# EAGLE design pinoccio (EAGLE 6.2)
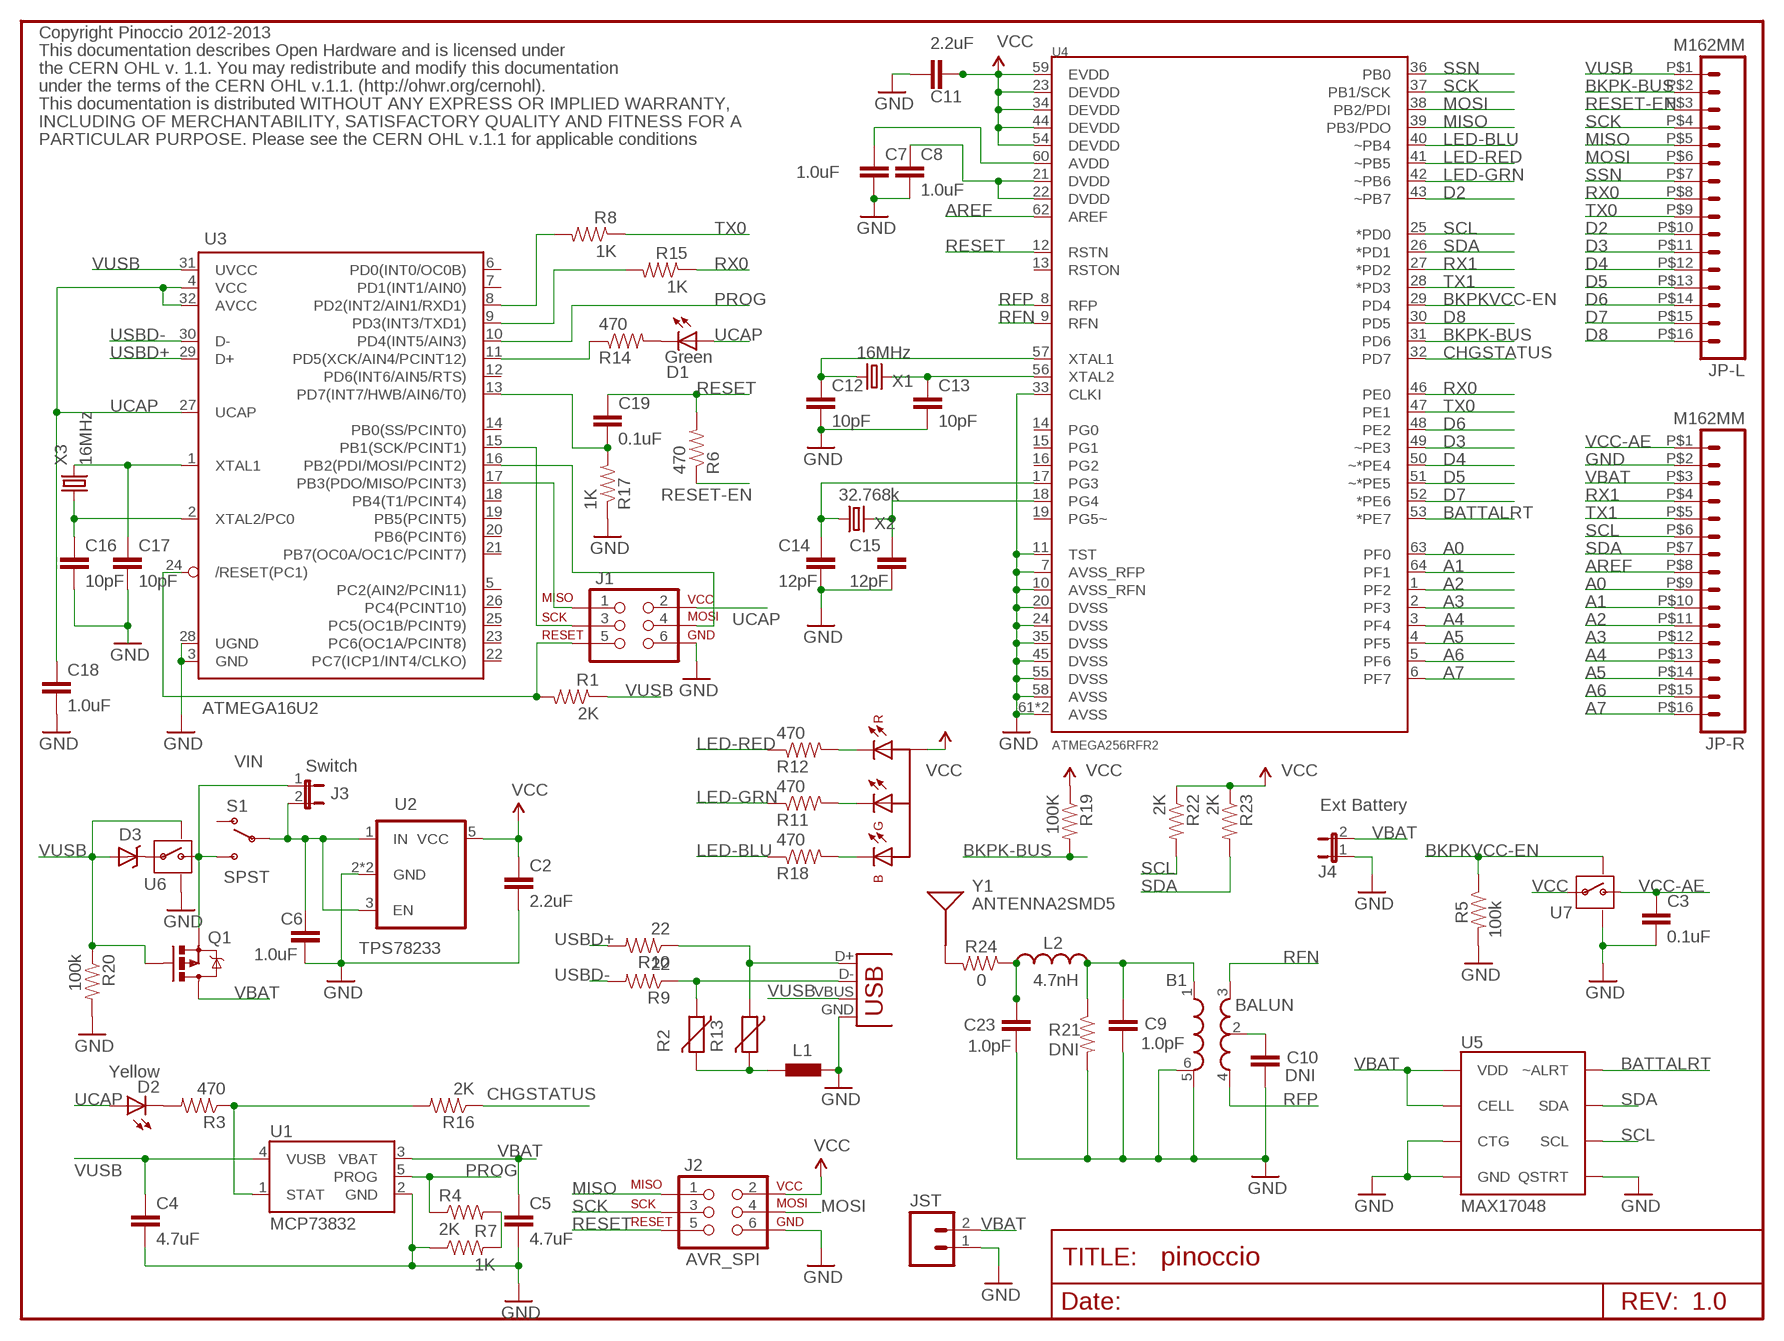
[diagram p0: schematic, sheet 1]

## Parts
B1  BALUN  BALUN0805  [BALUN]
C2  2.2uF  CAP0402-CAP  [0402-CAP]
C3  0.1uF  CAP0402-CAP  [0402-CAP]
C4  4.7uF  CAP0402-CAP  [0402-CAP]
C5  4.7uF  CAP0402-CAP  [0402-CAP]
C6  1.0uF  CAP0402-CAP  [0402-CAP]
C7  1.0uF  CAP0402-CAP  [0402-CAP]
C8  1.0uF  CAP0402-CAP  [0402-CAP]
C9  1.0pF  CAP0402-CAP  [0402-CAP]
C10  DNI  CAP0402-CAP  [0402-CAP]
C11  2.2uF  CAP0402-CAP  [0402-CAP]
C12  10pF  CAP0402-CAP  [0402-CAP]
C13  10pF  CAP0402-CAP  [0402-CAP]
C14  12pF  CAP0402-CAP  [0402-CAP]
C15  12pF  CAP0402-CAP  [0402-CAP]
C16  10pF  CAP0402-CAP  [0402-CAP]
C17  10pF  CAP0402-CAP  [0402-CAP]
C18  1.0uF  CAP0402-CAP  [0402-CAP]
C19  0.1uF  CAP0402-CAP  [0402-CAP]
C23  1.0pF  CAP0402-CAP  [0402-CAP]
D1  Green  LED0603  [LED-0603]
D2  Yellow  LED0603  [LED-0603]
D3  DIODE-SCHOTTKY  [0603-DIODE]
J1  AVR_SPI_PRG_6  [2X3-PAD]
J2  AVR_SPI  AVR_SPI_PRG_6  [2X3-PAD]
J3  Switch  JUMPER-2PTH  [1X02]
J4  Ext Battery  JUMPER-2PTH  [1X02]
JP-L  M162MM  [1X16_2MM]
JP-R  M162MM  [1X16_2MM]
JST  M02JST-SFH  [JST-SFH]
L1  BEAD  BML15H0603  [0603]
L2  4.7nH  INDUCTOR  [0402-CAP]
Q1  PFET  MOSFET-PCHANNELSMD  [SOT23-3]
R1  2K  RESISTOR0402-RES  [0402-RES]
R2  VAR  VARISTOR0402  [0402]
R3  470  RESISTOR0402-RES  [0402-RES]
R4  2K  RESISTOR0402-RES  [0402-RES]
R5  100k  RESISTOR0402-RES  [0402-RES]
R6  470  RESISTOR0402-RES  [0402-RES]
R7  1K  RESISTOR0402-RES  [0402-RES]
R8  1K  RESISTOR0402-RES  [0402-RES]
R9  22  RESISTOR0402-RES  [0402-RES]
R10  22  RESISTOR0402-RES  [0402-RES]
R11  470  RESISTOR0402-RES  [0402-RES]
R12  470  RESISTOR0402-RES  [0402-RES]
R13  VAR  VARISTOR0402  [0402]
R14  470  RESISTOR0402-RES  [0402-RES]
R15  1K  RESISTOR0402-RES  [0402-RES]
R16  2K  RESISTOR0402-RES  [0402-RES]
R17  1K  RESISTOR0402-RES  [0402-RES]
R18  470  RESISTOR0402-RES  [0402-RES]
R19  100K  RESISTOR0402-RES  [0402-RES]
R20  100k  RESISTOR0402-RES  [0402-RES]
R21  DNI  RESISTOR0402-RES  [0402-RES]
R22  2K  RESISTOR0402-RES  [0402-RES]
R23  2K  RESISTOR0402-RES  [0402-RES]
R24  0  RESISTOR0402-RES  [0402-RES]
S1  SPST  SWITCH-SPSTSMD2  [SWITCH-SPDT-SMD]
U1  MCP73832  [SOT23-5]
U2  TPS78233  LDO-TPS78233  [SOT23-5]
U3  ATMEGA16U2  ATMEGA16U2QFN32  [QFN-32]
U4  ATMEGA256RFR2  ATMEGA128RFA1  [QFN-64]
U5  MAX17048  MAX17048DFN8  [DFN-8]
U6  SWITCH  SWITCH-MOSFETTDFN4  [TDFN4]
U7  SWITCH  SWITCH-MOSFETTDFN4  [TDFN4]
U8  LED-RGB  LED-RGBPLCC4  [PLCC4]
USB-JACK  USB-MICROB  [USB-MICROB]
X1  16MHz  CRYSTALABM10  [CRYSTAL-SMD-2.5X2-ABM10]
X2  32.768k  CRYSTAL-NOGND  [CRYSTAL-SMD-2X1.2-ABS06]
X3  16MHz  CRYSTALABM10  [CRYSTAL-SMD-2.5X2-ABM10]
Y1  ANTENNA2SMD5  [ANTENNA-CHIP5]

## Nets
A0: JP-R.P$9 U4.63(PF0)
A1: JP-R.P$10 U4.64(PF1)
A2: JP-R.P$11 U4.1(PF2)
A3: JP-R.P$12 U4.2(PF3)
A4: JP-R.P$13 U4.3(PF4)
A5: JP-R.P$14 U4.4(PF5)
A6: JP-R.P$15 U4.5(PF6)
A7: JP-R.P$16 U4.6(PF7)
AREF: JP-R.P$8 U4.62(AREF)
BATTALRT: U4.53(*PE7) U5.P$5(~ALRT)
BKPK-BUS: JP-L.P$2 R19.2 U4.31(PD6)
BKPKVCC-EN: R5.1 U4.29(PD4) U7.P$4(ON)
CHGSTATUS: R16.1 U4.32(PD7)
D2: JP-L.P$10 U4.43(~PB7)
D3: JP-L.P$11 U4.49(~PE3)
D4: JP-L.P$12 U4.50(~*PE4)
D5: JP-L.P$13 U4.51(~*PE5)
D6: JP-L.P$14 U4.48(PE2)
D7: JP-L.P$15 U4.52(*PE6)
D8: JP-L.P$16 U4.30(PD5)
GND [GND]: B1.5(GND) B1.6(GND) C2.2 C3.2 C4.2 C5.2 C6.2 C7.2 C8.2 C9.2 C10.2 C11.2 C12.2 C13.2 C14.2 C15.2 C16.2 C17.2 C18.2 C23.2 J1.6 J2.6 J4.1 JP-R.P$2 JST.1 L1.1 R5.2 R7.1 R17.1 R20.2 R21.2 U1.2(GND) U2.2(GND) U2.4(GND) U3.3(GND) U3.28(UGND) U4.7(AVSS_RFP) U4.10(AVSS_RFN) U4.11(TST) U4.20(DVSS) U4.24(DVSS) U4.33(CLKI) U4.35(DVSS) U4.45(DVSS) U4.55(DVSS) U4.58(AVSS) U4.61(AVSS) U4.PADDLE(AVSS) U5.P$1(CTG) U5.P$4(GND) U5.P$6(QSTRT) U5.P$9(GND) U6.P$2(GND) U6.P$5(GND) U7.P$2(GND) U7.P$5(GND) USB-JACK.GND
LED-BLU: R18.1 U4.40(~PB4)
LED-GRN: R11.1 U4.42(~PB6)
LED-RED: R12.1 U4.41(~PB5)
MISO: J2.1 JP-L.P$5 U4.39(PB3/PDO)
MOSI: J2.4 JP-L.P$6 U4.38(PB2/PDI)
N$1: R12.2 U8.P$1(R-C)
N$2: R2.1 R9.1 USB-JACK.D-
N$3: D3.C U6.P$3(IN)
N$4 [RF Antenna]: B1.1(IN) C9.1 L2.1 R21.1
N$5: R11.2 U8.P$4(G-C)
N$6: R18.2 U8.P$3(B-C)
N$7: J1.5 R1.2 U3.24(/RESET(PC1))
N$8: R4.2 R7.2
N$9: L1.2 R2.2 R13.2
N$10: C7.1 U4.60(AVDD)
N$11: R3.1 R16.2 U1.1(STAT)
N$13: B1.2(RFGND) C10.1
N$15: C12.1 U4.57(XTAL1) X1.P$1
N$16: C13.1 U4.56(XTAL2) X1.P$3
N$17: C14.1 U4.17(PG3) X2.P$1
N$18: C15.1 U4.18(PG4) X2.P$2
N$19: C16.1 U3.2(XTAL2/PC0) X3.P$1
N$20: C8.1 U4.21(DVDD) U4.22(DVDD)
N$21: C17.1 U3.1(XTAL1) X3.P$3
N$22: D2.C R3.2
N$24: C19.2 R17.2 U3.13(PD7(INT7/HWB/AIN6/T0))
N$25: R15.2 U3.9(PD3(INT3/TXD1))
N$26: R8.2 U3.8(PD2(INT2/AIN1/RXD1))
N$27: C23.1 L2.2 R24.1
N$28: R24.2 Y1.FEED(SIGNAL)
N$43: R10.1 R13.1 USB-JACK.D+
N$51: J3.1 Q1.2(S) S1.3(S) U6.P$1(OUT)
N$56: J1.1 U3.17(PB3(PDO/MISO/PCINT3))
N$57: J1.4 U3.16(PB2(PDI/MOSI/PCINT2))
N$58: J1.3 U3.15(PB1(SCK/PCINT1))
N$59: R14.1 U3.11(PD5(XCK/AIN4/PCINT12))
N$62: D1.C R14.2
PROG: R4.1 U1.5(PROG) U3.10(PD4(INT5/AIN3))
RESET: C19.1 J2.5 R6.2 U4.12(RSTN)
RESET-EN: JP-L.P$3 R6.1
RFN: B1.3(OUT1) U4.9(RFN)
RFP: B1.4(OUT2) U4.8(RFP)
RX0: JP-L.P$8 R15.1 U4.46(PE0)
RX1: JP-R.P$4 U4.27(*PD2)
SCK: J2.3 JP-L.P$4 U4.37(PB1/SCK)
SCL: JP-R.P$6 R22.2 U4.25(*PD0) U5.P$7(SCL)
SDA: JP-R.P$7 R23.2 U4.26(*PD1) U5.P$8(SDA)
SSN: JP-L.P$7 U4.36(PB0)
TX0: JP-L.P$9 R8.1 U4.47(PE1)
TX1: JP-R.P$5 U4.28(*PD3)
UCAP: C18.1 D1.A D2.A J1.2 U3.4(VCC) U3.27(UCAP) U3.32(AVCC)
USBD+: R10.2 U3.29(D+)
USBD-: R9.2 U3.30(D-)
VBAT: C5.1 J4.2 JP-R.P$3 JST.2 Q1.3(D) U1.3(VBAT) U5.P$2(CELL) U5.P$3(VDD)
VCC [VCC]: C2.1 C11.1 J2.2 R19.1 R22.1 R23.1 U2.5(VCC) U4.23(DEVDD) U4.34(DEVDD) U4.44(DEVDD) U4.54(DEVDD) U4.59(EVDD) U7.P$3(IN) U8.P$2(A)
VCC-AE: C3.1 JP-R.P$1 U7.P$1(OUT)
VIN: C6.1 J3.2 S1.2(P) U2.1(IN) U2.3(EN)
VUSB: C4.1 D3.A JP-L.P$1 Q1.1(G) R1.1 R20.1 U1.4(VUSB) U3.31(UVCC) U6.P$4(ON) USB-JACK.VBUS
Unconnected: S1.1(O) U3.5(PC2(AIN2/PCIN11)) U3.6(PD0(INT0/OC0B)) U3.7(PD1(INT1/AIN0)) U3.12(PD6(INT6/AIN5/RTS)) U3.14(PB0(SS/PCINT0)) U3.18(PB4(T1/PCINT4)) U3.19(PB5(PCINT5)) U3.20(PB6(PCINT6)) U3.21(PB7(OC0A/OC1C/PCINT7)) U3.22(PC7(ICP1/INT4/CLKO)) U3.23(PC6(OC1A/PCINT8)) U3.25(PC5(OC1B/PCINT9)) U3.26(PC4(PCINT10)) U4.13(RSTON) U4.14(PG0) U4.15(PG1) U4.16(PG2) U4.19(PG5~)

## Notes on the sheet
- Copyright Pinoccio 2012-2013
- This documentation describes Open Hardware and is licensed under
- the CERN OHL v. 1.1. You may redistribute and modify this documentation
- under the terms of the CERN OHL v.1.1. (http://ohwr.org/cernohl).
- This documentation is distributed WITHOUT ANY EXPRESS OR IMPLIED WARRANTY,
- INCLUDING OF MERCHANTABILITY, SATISFACTORY QUALITY AND FITNESS FOR A
- PARTICULAR PURPOSE. Please see the CERN OHL v.1.1 for applicable conditions
- 1.0
- /Volumes/Data/Users/eric/Desktop/pinoccio.bmp
- /Volumes/Data/Users/eric/Desktop/pinoccio-1in.bmp | /Volumes/Data/Users/eric/Desktop/pinoccio-full-3-4in.bmp | /Volumes/Data/Users/eric/Desktop/pinoccio-full-3-4in.bmp

## Power pins joined to a net without a drawn wire
GND: X1.P$2(GND) X1.P$4(GND) X3.P$2(GND) X3.P$4(GND)

## Library data of the parts
B1 = Pinoccio:BALUN
C2-C19 C23 = Pinoccio:CAP: Capacitor Standard 0603 ceramic capacitor, and 0.1" leaded capacitor.
D1 D2 = Pinoccio:LED: LEDs Standard schematic elements and footprints for 5mm, 3mm, 1206, and 0603 sized LEDs. 5mm - Spark Fun Electronics SKU : COM-00529 (and others)
D3 = Pinoccio:DIODE-SCHOTTKY
J1 J2 = Pinoccio:AVR_SPI_PRG_6: AVR ISP 6 Pin This is the reduced ISP connector for AVR programming. Common on Arduino. This footprint will take up less PCB space and can be used with a 10-pin to 6-pin adapter such as SKU: BOB-08508
J3 J4 = Pinoccio:JUMPER-2: Jumper Basic 0.1" spaced jumper. Use with breakaway headers.
JP-L JP-R = Pinoccio:M16
JST = bean:M02: Header 2 Standard 2-pin 0.1" header. Use with straight break away headers (SKU : PRT-00116), right angle break away headers (PRT-00553), swiss pins (PRT-00743), machine pins (PRT-00117), and female headers (PRT-00115). Molex polarized connector foot print use with SKU : PRT-08233 with associated crimp pins and housings.
L1 = Pinoccio:BML15H: EMIFIL (R) Chip Ferrite Bead for GHz Noise Source: http://www.murata.com/ Ferrite Bead BLM18K
L2 = Pinoccio:INDUCTOR
Q1 = Pinoccio:MOSFET-PCHANNEL
R1 R3-R12 R14-R24 = Pinoccio:RESISTOR: Resistor Basic schematic elements and footprints for 0603, 1206, and PTH resistors.
R2 R13 = Pinoccio:VARISTOR: VARISTOR
S1 = Pinoccio:SWITCH-SPST: SPST Switch Simple slide switch. Spark Fun Electronics SKU : COM-00102
U1 = Pinoccio:MCP73832: Microchip's MCP73832 Miniature single cell, fully integrated Li-Ion, Li-polymer charge management controller http://ww1.microchip.com/downloads/en/DeviceDoc/21984a.pdf
U2 = Pinoccio:LDO-TPS78233: Voltage Regulator LDO 500nA Ground Current, 150mA, Ultra-Low Quiescent Current Low-Dropout Linear Regulator.
U3 = Pinoccio:ATMEGA16U2: ATmega16u2 Pin compatible with the atmega8u2, atmega16u2 and atmega32u2 8, 16 or 32 K flash, 1K RAM, 512b EEPROM 8 bit and 16 bit timer (5 PWM total) UART, SPI (no I2C!) USB with 4 endpoints, LUFA compatible 22 I/O lines, analog comparator (no ADC!) Comes with DFU bootloader burned in!
U4 = Pinoccio:ATMEGA128RFA1
U5 = Pinoccio:MAX17048
U6 U7 = Pinoccio:SWITCH-MOSFET
U8 = Pinoccio:LED-RGB: LED-Bicolor Red/Green
USB-JACK = Pinoccio:USB: USB Connectors USB-B-PTH is fully proven SKU : PRT-00139 USB-miniB is fully proven SKU : PRT-00587 USB-A-PCB is untested. USB-A-H is throughly reviewed, but untested. Spark Fun Electronics SKU : PRT-00437 USB-B-SMT is throughly reviewed, but untested. Needs silkscreen touching up. USB-A-S has not been used/tested USB-MB-H has not been used/tested
X1 X3 = Pinoccio:CRYSTAL: Crystals Various standard crystals. Proven footprints. Spark Fun Electronics SKU : COM-00534
X2 = Pinoccio:CRYSTAL-NOGND
Y1 = SparkFun:ANTENNA2: Antenna Single endded antenna. Common with smaller chip antennas. CHIP4 package is the GPS Chip Antenna SKU: GPS-08418. CHIP5 package is 2.4GHz chip antenna SKU: WRL-00144.

## Net classes
0 Default: width 0.203 mm
1 VCC: width 0.305 mm
2 LEDPower: width 0.203 mm
3 ButtonSignal: width 0.203 mm
4 RF Antenna: width 0.305 mm
5 GND: width 0.203 mm

## Board
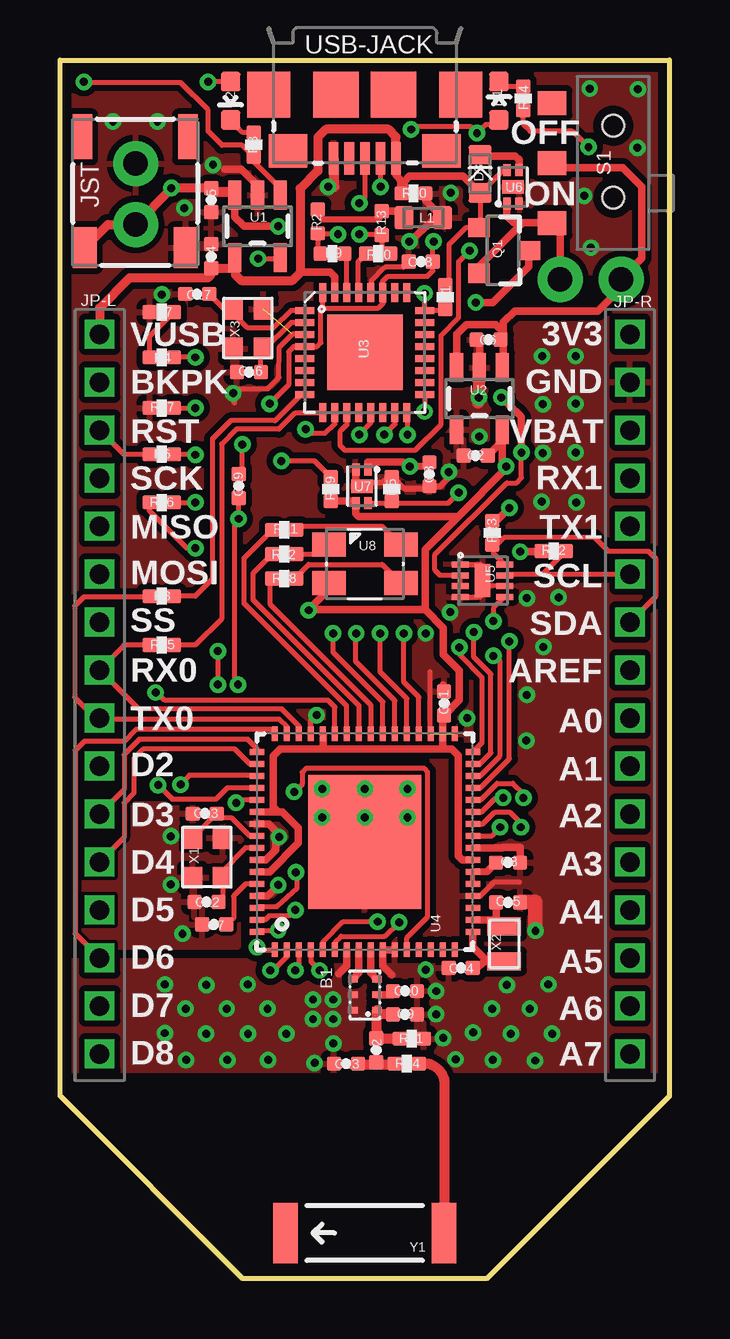
[diagram p1: board, top side]
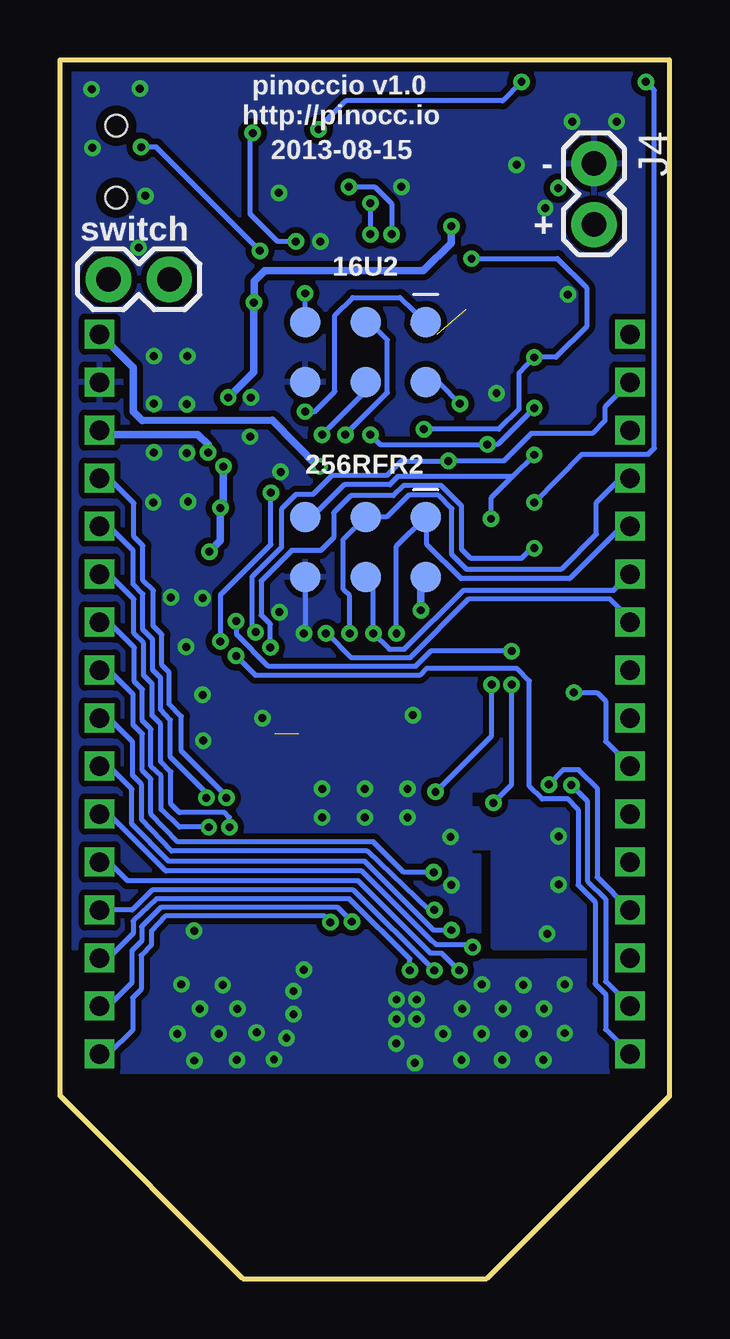
[diagram p2: board, bottom side, seen from below]

Size 25.4 x 50.8 mm. Coordinates in mm from the lower left corner, seen from the top.
Outline: 17.78,0 7.62,0 0,7.62 0,50.8 25.4,50.8 25.4,7.62 17.78,0
Copper layers (1*16): Top 0.0356mm / dielectric 1.5011mm / Bottom 0.0356mm
Design rules: minimum track width 6mil, minimum drill 13mil, track to track 6mil, track to pad 6mil, pad to pad 6mil, via to via 6mil, smd to smd 6mil, copper to edge 15mil, drill to drill 6mil, minimum pad ring 7mil, minimum via ring 7mil, stop-mask expansion 4mil, vias tented up to drill 16mil, thermal gap 10mil
tKeepout: area 12.5,11.3 to 13.4,11.7; area 11.5,11.9 to 12.2,12.4; area 13.1,12.1 to 13.7,12.4; area 11.5,11.7 to 12,11.9; area 11.5,11.3 to 12.4,11.7

### Footprints (pad centres in the part's own frame; a part is rotated, then mirrored left to right if it is on the bottom)
BALUN = smd 0.27 x 0.4: 1 -0.7,-0.5; 2 -0.05,-0.5; 3 0.6,-0.5; 4 0.6,0.5; 5 -0.05,0.5; 6 -0.7,0.5
0402-CAP = smd 0.6 x 0.6: 1 -0.5,0; 2 0.5,0
LED-0603 = smd 0.8 x 0.8: A 0,-0.8; C 0,0.8
0603-DIODE = smd 0.8 x 0.95: A -0.8,0; C 0.8,0
2X3-PAD = smd 1.27 x 1.27: 1 0,0; 2 0,2.508; 3 2.508,0; 4 2.508,2.508; 5 5.016,0; 6 5.016,2.508
1X02 = drill 1.016 pad 1.88: 1 0,0; 2 2.54,0
1X16_2MM = drill 0.813 square: P$1 0,0; P$2 2,0; P$3 4,0; P$4 6,0; P$5 8,0; P$6 10,0; P$7 12,0; P$8 14,0; P$9 16,0; P$10 18,0; P$11 20,0; P$12 22,0; P$13 24,0; P$14 26,0; P$15 28,0; P$16 30,0
JST-SFH = smd 1.7 x 1: 1 5.36,4.7; 2 5.36,0.5 | smd 1.876 x 0.813: P$0 0.74,4.8; P$1 0.74,0.4
0603 = smd 0.8 x 0.95: 1 -0.8,0; 2 0.8,0
SOT23-3 = smd 0.8 x 0.9: 1 -0.95,-1; 2 0.95,-1; 3 0,1.1
0402-RES = smd 0.6 x 0.6: 1 -0.5,0; 2 0.5,0
0402 = smd 0.6 x 0.6: 1 -0.5,0; 2 0.5,0
SWITCH-SPDT-SMD = smd 1 x 1.2: 1 -2.5,-2.55; 2 0,-2.55; 3 2.5,-2.55 | hole 0.9: -1.55,0; 1.45,0
SOT23-5 = smd 0.55 x 1.2: 1 -0.95,-1.3; 2 0,-1.3; 3 0.95,-1.3; 4 0.95,1.3; 5 -0.95,1.3
QFN-32 = smd 0.285 x 0.8: 1 -1.75,-2.5; 2 -1.25,-2.5; 3 -0.75,-2.5; 4 -0.25,-2.5; 5 0.25,-2.5; 6 0.75,-2.5; 7 1.25,-2.5; 8 1.75,-2.5; 17 1.75,2.5; 18 1.25,2.5; 19 0.75,2.5; 20 0.25,2.5; 21 -0.25,2.5; 22 -0.75,2.5; 23 -1.25,2.5; 24 -1.75,2.5 | smd 0.8 x 0.285: 9 2.5,-1.75; 10 2.5,-1.25; 11 2.5,-0.75; 12 2.5,-0.25; 13 2.5,0.25; 14 2.5,0.75; 15 2.5,1.25; 16 2.5,1.75; 25 -2.5,1.75; 26 -2.5,1.25; 27 -2.5,0.75; 28 -2.5,0.25; 29 -2.5,-0.25; 30 -2.5,-0.75; 31 -2.5,-1.25; 32 -2.5,-1.75 | smd 3.15 x 3.15: EP 0,0
QFN-64 = smd 0.6 x 0.25: 1 -4.5,3.75; 2 -4.5,3.25; 3 -4.5,2.75; 4 -4.5,2.25; 5 -4.5,1.75; 6 -4.5,1.25; 7 -4.5,0.75; 8 -4.5,0.25; 9 -4.5,-0.25; 10 -4.5,-0.75; 11 -4.5,-1.25; 12 -4.5,-1.75; 13 -4.5,-2.25; 14 -4.5,-2.75; 15 -4.5,-3.25; 16 -4.5,-3.75; 33 4.5,-3.75; 34 4.5,-3.25; 35 4.5,-2.75; 36 4.5,-2.25; 37 4.5,-1.75; 38 4.5,-1.25; 39 4.5,-0.75; 40 4.5,-0.25; 41 4.5,0.25; 42 4.5,0.75; 43 4.5,1.25; 44 4.5,1.75; 45 4.5,2.25; 46 4.5,2.75; 47 4.5,3.25; 48 4.5,3.75 | smd 0.25 x 0.6: 17 -3.75,-4.5; 18 -3.25,-4.5; 19 -2.75,-4.5; 20 -2.25,-4.5; 21 -1.75,-4.5; 22 -1.25,-4.5; 23 -0.75,-4.5; 24 -0.25,-4.5; 25 0.25,-4.5; 26 0.75,-4.5; 27 1.25,-4.5; 28 1.75,-4.5; 29 2.25,-4.5; 30 2.75,-4.5; 31 3.25,-4.5; 32 3.75,-4.5; 49 3.75,4.5; 50 3.25,4.5; 51 2.75,4.5; 52 2.25,4.5; 53 1.75,4.5; 54 1.25,4.5; 55 0.75,4.5; 56 0.25,4.5; 57 -0.25,4.5; 58 -0.75,4.5; 59 -1.25,4.5; 60 -1.75,4.5; 61 -2.25,4.5; 62 -2.75,4.5; 63 -3.25,4.5; 64 -3.75,4.5 | smd 5.588 x 4.699: PADDLE 0,0
DFN-8 = smd 0.25 x 0.7: P$1 0.125,0.35; P$2 0.575,0.35; P$3 1.025,0.35; P$4 1.475,0.35; P$5 1.475,2.2; P$6 1.025,2.2; P$7 0.575,2.2; P$8 0.125,2.2 | smd 1.37 x 0.64: P$9 0.8,1.275
TDFN4 = smd 0.325 x 0.5: P$1 0.35,0.1; P$2 0.85,0.1; P$3 0.85,1.5; P$4 0.35,1.5 | smd 0.9 x 0.55: P$5 0.6,0.8
PLCC4 = smd 1.4 x 1: P$1 -1.5,0.75; P$2 -1.5,-0.85; P$3 1.5,-0.85; P$4 1.5,0.75
USB-MICROB = smd 0.4 x 1.35: D+ 0,2.65; D- -0.65,2.65; GND 1.3,2.65; ID 0.65,2.65; VBUS -1.3,2.65 | smd 1.8 x 1.9: MT1 -4,0; MT2 4,0 | smd 1.9 x 1.9: MT3 -1.2,0; MT4 1.2,0 | smd 1.6 x 1.4: MT5 3.2,2.35; MT6 -3.2,2.35
CRYSTAL-SMD-2.5X2-ABM10 = smd 0.9 x 0.8: P$1 -0.85,-0.65; P$2 0.8,-0.65; P$3 0.8,0.6; P$4 -0.85,0.6
CRYSTAL-SMD-2X1.2-ABS06 = smd 0.75 x 1.4: P$1 -0.725,0; P$2 0.725,0
ANTENNA-CHIP5 = smd 1.016 x 2.54: FEED -3.302,0; NC 3.302,0

### Placement (x,y rotation side)
B1  12.7,11.89 90 top
C2  17.32,34.31 180 top
C3  15.39,33.53 270 top
C4  6.3,42.62 90 top
C5  6.3,44.96 270 top
C6  17.86,39.15 180 top
C7  6.43,14.77 180 top
C8  18.67,17.35 0 top
C9  14.38,11.02 0 top
C10  14.38,11.99 0 top
C11  16,23.98 90 top
C12  6.1,15.7 180 top
C13  6.04,19.39 180 top
C14  16.7,12.95 180 top
C15  18.67,15.69 0 top
C16  7.87,37.8 180 top
C17  5.71,41.05 180 top
C18  15.04,42.39 180 top
C19  7.44,33.05 90 top
C23  11.91,8.97 180 top
D1  18.29,49.1 0 top
D2  7.11,49.1 180 top
D3  17.5,46.05 90 top
J1  10.16,39.88 180 bottom
J2  10.16,31.75 180 bottom
J3  20.84,41.66 180 bottom
J4  3.15,46.48 270 bottom
JP-L  1.65,39.37 270 top
JP-R  23.75,39.37 270 top
JST  0.53,48.34 270 top
L1  15.14,44.22 180 top
L2  13.18,9.53 270 top
Q1  18.46,42.86 270 top
R1  16.05,40.92 270 top
R2  10.74,44.07 90 top
R3  8.08,47.27 90 top
R4  4.24,38.4 180 top
R5  13.82,32.92 90 top
R6  4.24,34.37 0 top
R7  4.24,40.28 0 top
R8  4.24,28.45 0 top
R9  11.35,42.72 0 top
R10  13.26,42.72 180 top
R11  9.35,31.22 0 top
R12  9.35,30.2 0 top
R13  13.41,43.99 90 top
R14  19.3,49.2 90 top
R15  4.24,26.42 0 top
R16  4.24,32.36 0 top
R17  4.24,36.3 0 top
R18  9.35,29.18 0 top
R19  11.28,32.92 90 top
R20  14.73,45.24 0 top
R21  14.66,10.01 0 top
R22  20.57,30.33 0 top
R23  18.01,31.09 270 top
R24  14.45,8.97 0 top
S1  23.05,46.51 270 top
U1  8.23,43.87 180 top
U2  17.47,36.68 180 top
U3  12.7,38.61 270 top
U4  12.7,18.21 90 top
U5  16.33,29.9 270 top
U6  18.28,44.71 0 top
U7  13.18,33.83 180 top
U8  12.7,29.84 0 top
USB-JACK  12.7,49.35 180 top
X1  6.12,17.57 90 top
X2  18.51,13.96 90 top
X3  7.82,39.62 90 top
Y1  12.7,1.91 180 top

### Tracks (layer width: path | path; a pad name or v marks a point on that pad's centre or on a via)
A0  (via drill 0.33)
  Top 0.203: v9.8,15.37 9.58,15.14 8.73,15.14 8.55,14.96 U4.63 | U4.63 8.18,14.96 | U4.63
  Bottom 0.203: v9.8,15.37 10.03,15.37 12.6,17.83 20.75,17.83 22,19.15 22,20.6 22.38,20.98 22.38,22.38 23.37,23.37 JP-R.P$9
A1  (via drill 0.33)
  Top 0.203: U4.64 8.27,14.53 v9.09,14.53
  Bottom 0.203: v9.09,14.53 9.83,14.53 12.7,17.4 20.88,17.4 22.4,18.95 22.4,20.41 23.37,21.37 JP-R.P$10
A2  (via drill 0.33)
  Top 0.203: v8.2,13.82 8.31,13.71 U4.1
  Bottom 0.203: v8.2,13.82 8.31,13.92 9.73,13.92 9.96,14.12 12.83,16.99 20.99,16.99 23.37,19.37 JP-R.P$11
A3  (via drill 0.33)
  Top 0.203: U4.2 9.45,13.41 8.89,12.85 v8.76,12.85
  Bottom 0.203: v8.76,12.85 8.76,12.83 9.5,13.56 9.96,13.56 12.98,16.59 22.58,16.59 23.37,17.37 JP-R.P$12
A4  (via drill 0.33)
  Top 0.203: U4.3 9.95,13 v9.8,12.85
  Bottom 0.203: v9.8,12.85 13.18,16.2 21.57,16.2 22.4,15.37 JP-R.P$13
A5  (via drill 0.33)
  Top 0.203: U4.4 10.45,13.22 v10.82,12.85
  Bottom 0.203: v10.82,12.85 10.82,13.34 13.35,15.84 21.38,15.84 22.35,14.91 22.35,14.39 23.37,13.37 JP-R.P$14
A6  (via drill 0.33)
  Top 0.203: U4.5 10.95,14.02 11.81,14.88 v13.24,14.88
  Bottom 0.203: v13.24,14.88 13.82,15.47 21.2,15.47 22,14.68 22,14.07 22.4,13.66 22.4,12.34 23.37,11.37 JP-R.P$15
A7  (via drill 0.33)
  Top 0.203: U4.6 11.45,14.02 11.71,14.28 13.53,14.28 v14.13,14.86
  Bottom 0.203: v14.13,14.86 14.15,14.88 14.38,15.11 21.01,15.11 21.59,14.5 21.59,13.92 22.02,13.49 22.02,12.06 22.38,11.71 22.38,10.36 23.37,9.37 JP-R.P$16
AREF  (via drill 0.33)
  Top 0.203: v9.83,16.94 9.88,16.92 9.88,16.28 9.04,15.51 8.25,15.51 U4.62
  Bottom 0.203: v9.83,16.94 11.07,16.94 12.34,18.21 20.5,18.21 21.61,19.38 21.61,20.83 21.97,21.18 21.97,22.71 22.35,23.09 22.35,24.35 23.37,25.37 JP-R.P$8
BATTALRT  (via drill 0.33)
  Top 0.203: U5.P$5 18.06,27.95 v18.06,27.41 | U4.53 7.46,19.96 v7.34,19.84 | v6.58,26.16 v6.58,24.77
  Bottom 0.203: v7.34,19.84 6.58,20.6 v6.58,24.77 | v6.58,26.16 9.96,26.16 10.59,25.53 16.71,25.53 18.03,26.85 18.03,27.38 v18.06,27.41
BKPK-BUS  (via drill 0.33)
  Top 0.203: U4.31 17.5,21.46 17.96,21.92 17.96,25.2 17.25,25.91 v17.25,26.95 | R19.2 10.61,34.09 v9.22,34.09
  Bottom 0.203: v17.25,26.95 17.4,27.1 17.4,29.26 16.18,30.48 16.18,32.08 15.57,32.69 14.86,32.69 14.07,33.48 11.79,33.48 11.18,34.09 v9.22,34.09 6.91,34.09 5.77,35.23 3.23,35.23 2.69,35.76 2.69,36.33 JP-L.P$2
BKPKVCC-EN  (via drill 0.33)
  Top 0.203: U4.29 17.52,20.46 18.72,21.67 v18.72,26.57 | U7.P$4 13.73,32.33 R5.1 13.88,32.33 16.18,32.33 v16.61,32.77
  Bottom 0.203: v16.61,32.77 16.61,30.61 18.72,28.5 v18.72,26.57
CHGSTATUS  (via drill 0.33)
  Top 0.203: v16.64,26.31 16.64,26.01 17.58,25.07 17.58,22.34 U4.32 | R16.1 3.72,32.02 5.28,30.45 v5.64,30.45 5.61,30.43
  Bottom 0.203: v16.64,26.31 16.64,27.28 17.02,27.66 17.02,29.08 15.75,30.35 14.53,30.35 13.99,30.89 13.99,31.93 13.28,32.64 11.51,32.64 11.07,33.07 9.53,33.07 8.66,32.21 8.66,30.4 8.28,30.02 6.17,30.02 5.77,30.43 5.66,30.43 v5.64,30.45
D2  (via drill 0.33)
  Top 0.203: U4.43 11.45,23.83 11.18,24.11 4.37,24.11 3.99,24.49 v3.99,24.43
  Bottom 0.203: v3.99,24.43 3.02,24.43 2.67,24.08 2.67,22.39 JP-L.P$10
D3
  Top 0.203: U4.49 8.2,22.1 7.82,22.48 3.3,22.48 2.67,21.84 2.67,20.39 JP-L.P$11
D4
  Top 0.203: U4.50 7.9,21.46 7.29,22.07 3.45,22.07 3.07,21.69 3.07,20.24 2.67,19.84 2.67,18.39 JP-L.P$12
D5  (via drill 0.33)
  Top 0.203: U4.51 8.18,20.98 5.38,20.98 v5.03,20.6
  Bottom 0.203: v5.03,20.6 4.45,21.21 3.79,21.21 3.02,20.45 3.02,16.74 JP-L.P$13
D6
  Top 0.203: U4.48 8.78,22.89 3.15,22.89 2.67,22.4 1.02,22.4 0.64,22.02 0.64,14.39 JP-L.P$14
D7  (via drill 0.33)
  Top 0.203: v4.09,20.57 4.67,19.99 6.5,19.99 6.99,20.47 8.19,20.47 U4.52
  Bottom 0.203: v4.09,20.57 3.43,19.91 3.43,16.59 2.67,15.82 2.67,12.39 JP-L.P$15
D8  (via drill 0.33)
  Top 0.203: U4.30 17.51,20.96 18.34,21.79 18.34,25.73 18.09,25.98 v18.06,25.96
  Bottom 0.203: JP-L.P$16 2.67,10.39 2.67,11.86 3.1,12.29 3.1,15.7 3.81,16.41 3.81,19.56 4.22,19.99 5.31,19.99 5.84,20.52 5.84,24.92 6.35,25.43 10.13,25.43 10.41,25.15 17.25,25.15 v18.06,25.96
GND  (via drill 0.33)  (2 unrouted)
  Top 0.203: U4.35 15.42,22.73 15.42,25.3 | U3.28 12.95,41.37 12.98,41.4 12.98,41.6 13.54,42.16 14.31,42.16 C18.2 | U4.45 10.45,23.33 v10.69,23.5 | U3.3 10.19,39.37 9.68,39.37 9.14,38.84 9.12,37.57 8.64,37.08 7.26,37.08 7.21,37.13 | 7.21,37.13 7.26,36.5 v7.21,36.91 | 7.22,37.14 7.21,37.13 | U4.20 17.51,15.96 18.09,16.54 19.15,16.54 | U5.P$4 17.52,28.42 17.6,28.7 17.68,28.89 U5.P$9 | U5.P$1 17.52,29.77 17.48,29.18 U5.P$9 | U5.P$6 17.65,28.9 U5.P$9 | C3.2 15.71,33.03
  Top 0.254: U7.P$5 12.62,33.19 13.46,33.2 13.69,33.42 R5.2 13.88,33.42 14.35,32.94 15.31,32.94 C3.2 | 15.71,33.03 15.83,33.03 16.33,33.53 v16.2,33.63
  Top 0.305: U4.7 11.95,13.04 11.61,12.7 | U4.10 13.45,13.04 13.82,12.68 | U4.61 8.65,15.96 v9.09,16.41 | U4.10 | U4.58 8.57,17.46 8.99,17.88 8.99,18.67 8.7,18.96 U4.55 | U4.11 U4.10 | U4.24 18.44,17.96 18.46,17.98 19.13,17.98 19.17,17.98 C8.2 | 15.98,24.74 C11.2 | C6.2 17.48,39.14 U2.2 17.47,37.88 | C15.2 19.15,15.7 | U7.P$2 12.33,33.26 U7.P$5 | U1.2 8.23,45.57 7.54,46.25 6.86,46.25 | v14.55,43.23 15.67,44.22 L1.1 15.23,44.93 R20.2
  Top 0.406: USB-JACK.GND 11.4,45.55 11.43,45.52
  Top 0.508: 17.5,37.55 17.5,37.85 17.47,37.88 17.47,36.71 17.45,36.68 17.42,36.54
  Top 0.61: 19.15,15.7 19.81,15.7 v19.81,14.5
  Bottom 0.203: J2.6 15.18,26.96 v15.24,26.9
  Bottom 0.305: v9.09,16.41 9.17,16.48
  other vias: 10.61,8.99 8.67,9.12 6.97,9.12 5.26,9.12 10.54,10.82 10.54,11.63 16.48,9.14 8.65,11.25 6.95,11.25 5.23,11.25 16.97,23.37 15.67,11.02 5.11,14.38 10.92,20.42 10.92,19.23 12.7,19.23 12.7,20.42 14.48,20.42 14.48,19.23 9.13,18.41 11.38,11.63 4.37,12.27 6.1,12.24 7.82,12.27 19.46,24.33 20.14,26.34 20.78,28.4 20.07,32.38 21.51,32.36 20.12,36.45 21.49,36.47 7.83,10.21 6.08,10.21 4.37,10.24 9.43,10.21 19.8,9.09 18.03,9.12 19.57,11.25 18.01,11.25 18.62,12.24 20.35,12.27 20.51,10.21 18.79,10.21 17.21,10.26 20.12,34.42 21.49,38.46 4.62,16.43 11.18,45.52 5.18,44.63 2.21,48.23 4.06,48.23 6.38,46.43 4.24,41.02 11.38,10.82 20.09,38.46 19.46,28.37 11.39,9.8 15.96,10.03 15.67,11.99 4.62,18.44 15.24,12.88 21.49,34.44 17.45,36.73 19.43,22.43 24.05,47.14 24.08,49.58 16.28,45.26 17.48,35.1 16.26,27.79 21.84,45.14 22.07,49.61 22.12,42.98
  pour Top (isolate 0.254): 2.97,50.83 22.38,50.8 24.66,50.82 25.32,50.82 25.34,50.29 25.35,41 25.37,39.75 25.35,39.09 25.4,13.83 17.42,13.79 17.17,13.79 8.2,13.77 8.36,20.38 -0.03,20.38 -0.05,39.42 -0.05,50.62 0.05,50.62 0.05,50.83
  pour Bottom (isolate 0.254): 3,50.8 25.43,50.83 25.43,50.75 25.35,50.75 25.35,40.41 25.37,39.22 25.37,33.48 25.4,13.8 17.27,13.82 17.2,13.82 8.31,13.79 8.31,20.38 0,20.35 -0.05,39.47 -0.05,39.67 0,40.44 0,50.8
  pour Top (isolate 0.254, rank 2): -0.13,13.26 7.9,13.26 7.9,13.94 17.35,13.94 25.53,13.92 25.48,8.64 -0.2,8.66
  pour Top: -0.28,13.82 -0.2,19.81 7.44,19.81 7.44,19.53 8.41,19.53 8.36,17.93 7.44,17.96 7.42,13.82
  pour Bottom (isolate 0.254): -0.13,14.5 -0.13,17.75 -0.08,19.81 7.47,19.89 7.44,19.58 8.03,19.58 8.51,19.61 8.48,17.98 7.37,17.98 7.37,13.82 -0.2,13.82
  pour Bottom (isolate 0.254): -0.1,13.28 7.92,13.23 7.92,17.63 17.22,17.65 25.53,17.65 25.48,13.82 25.48,13.51 25.5,8.64 -0.15,8.64
  pour Top (rank 2, no thermals): 12.32,11.94 10.97,11.91 11,9.8 12.29,9.8 12.29,10.19
  pour Bottom: 6.63,40.89 6.6,40.89 6.6,37.82 9.12,37.82 9.17,41 6.65,41 6.65,40.82
LED-BLU
  Top 0.203: U4.40 12.95,23.91 8.76,28.09 8.76,29.1 R18.1 8.66,29.35
LED-GRN
  Top 0.203: U4.42 11.94,22.72 11.94,23.88 7.67,28.14 7.67,30.04 R11.1
LED-RED
  Top 0.203: U4.41 12.45,23.9 8.05,28.3 8.05,29.41 R12.1
MISO  (via drill 0.33)
  Top 0.203: U4.39 13.45,24.04 11.38,26.11 v11.38,26.9
  Bottom 0.203: JP-L.P$5 1.98,31.37 4.17,29.18 8.69,29.18 10.11,30.61 10.11,31.7 J2.1 11.38,30.53 v11.38,26.9
MOSI  (via drill 0.33)
  Top 0.203: U4.38 13.95,24.1 12.32,25.73 12.32,26.87 v12.34,26.9
  Bottom 0.203: JP-L.P$6 2.32,28.7 8.59,28.7 11.05,26.24 11.68,26.24 v12.34,26.9 12.34,28.92 J2.4
N$1
  Top 0.203: R12.2 11.2,30.2 U8.P$1
N$2  (via drill 0.33)
  Top 0.203: USB-JACK.D- 13.35,45.76 v13.36,45.52 | 10.85,42.76 R9.1 10.74,42.83 R2.1 10.81,43.54 v11.58,43.54
  Bottom 0.203: v13.36,45.52 12.29,45.52 11.58,44.81 v11.58,43.54
N$3
  Top 0.305: 17.61,46.97 D3.C 17.56,46.79 18.14,46.79 18.29,46.79 18.97,46.79 19.13,46.63 U6.P$3
N$4
  Top 0.406: C9.1 13.2,11.02 | 13.2,11.02 13.2,10.33 L2.1 14.08,10.03 R21.1 | 13.2,11.02 B1.1
N$5
  Top 0.203: R11.2 10.08,31.37 13.41,31.37 14.19,30.59 U8.P$4
N$6
  Top 0.203: R18.2 9.85,29.25 10.36,29.77 13.43,29.77 U8.P$3
N$7  (via drill 0.33)
  Top 0.203: v15.19,41.07 U3.24 15.96,40.36 R1.2
  Bottom 0.203: J1.5 15.19,39.87 v15.19,41.07
N$8
  Top 0.203: R4.2 3.74,39.28 R7.2
N$9
  Top 0.254: R2.2 10.91,44.17 13.29,44.17 R13.2
  Top 0.305: R13.2 14.01,44.5 L1.2
N$10
  Top 0.203: U4.60 7.75,16.46 7.24,15.95 7.24,15.03 C7.1
  Top 0.254: U4.60
N$11  (via drill 0.33)
  Top 0.203: U1.1 9.18,45.48 9.1,45.53 8.08,46.56 R3.1 7.6,47.24 6.76,47.24 6.17,47.83 6.17,48.72 5.03,49.86 1.02,49.86 v0.99,49.89 | R16.2 v5.64,32.36
  Bottom 0.203: v5.64,32.36 3.66,34.37 0.89,34.37 0.64,34.62 0.64,49.53 v0.99,49.89
N$13
  Top 0.305: C10.1 13.86,11.84 B1.2
N$15
  Top 0.203: C12.1 6.77,15.85 X1.P$1 6.77,17.01 7.73,17.96 U4.57
N$16
  Top 0.203: 6.55,19.56 C13.1 | X1.P$3 5.7,18.55 C13.1 | U4.56 7.93,18.46 7.9,18.47 7.16,19.2 6.72,19.2 C13.1
N$17
  Top 0.305: U4.17 17.2,13.84 17.74,13.3 | 17.74,13.3 17.86,13.18 18.46,13.18 X2.P$1 | C14.1 17.27,12.82 17.74,13.3
N$18
  Top 0.305: C15.1 18.17,14.79 18.12,14.92 | 18.12,14.92 X2.P$2 | U4.18 18.06,14.96 18.12,14.92
N$19
  Top 0.203: U3.2 9.63,39.86 8.43,38.66 8.46,38.71 X3.P$1 8.37,38.47 C16.1
N$20
  Top 0.203: U4.21 U4.22
  Top 0.305: U4.22 17.8,16.99 C8.1
N$21
  Top 0.203: U3.1 9.96,40.36 9.63,40.36 8.89,39.62 7.82,39.62 7.22,40.22 X3.P$3 6.8,40.46 C17.1
N$22
  Top 0.203: R3.2 7.62,47.77 D2.C
N$24  (via drill 0.33)
  Top 0.203: U3.13 12.95,35.69 v12.47,35.18 | R17.2 v5.64,36.3 | C19.2 7.59,33.7 v7.59,34.77
  Bottom 0.203: v5.64,36.3 7.16,34.77 v7.59,34.77 12.06,34.77 v12.47,35.18
N$25
  Top 0.203: U3.9 10.41,36.09 9.8,36.09 9.12,35.41 7.34,35.41 6.73,34.8 6.73,27.51 5.64,26.42 R15.2
N$26
  Top 0.203: R8.2 5.64,28.45 6.35,29.16 6.35,35 7.11,35.76 8.97,35.76 10.05,36.85 10.19,36.85 U3.8
N$27
  Top 0.406: R24.1 14.1,8.91 | 14.1,8.91 14.12,8.99 | 14.1,8.91 13.26,8.91 | 13.26,8.91 L2.2 | 13.26,8.91 12.21,8.91 C23.1
N$28
  Top 0.406: R24.2 arc-90 16,8.3 Y1.FEED
N$43  (via drill 0.33)
  Top 0.203: 13.92,42.88 R10.1 13.41,43.06 R13.1 13.37,43.54 v12.47,43.54 | USB-JACK.D+ 12.7,45.06 v12.47,44.83
  Bottom 0.203: v12.47,44.83 v12.47,43.54
N$51
  Top 0.305: 20.05,44.01 S1.3 | S1.3 20.84,43.67 J3.1 | Q1.2 17.46,42.2 19.28,44.02 | 19.28,44.02 S1.3 | 19.28,44.02 18.9,44.02 18.62,44.3 18.62,44.8 U6.P$1
N$56  (via drill 0.33)
  Top 0.203: U3.17 15.44,36.91 15.19,36.78 v15.19,36.14
  Bottom 0.203: 10.72,39.78 J1.1 11.23,40.89 13.21,40.89 13.95,40.16 13.95,36.98 14.78,36.14 v15.19,36.14
N$57  (via drill 0.33)
  Top 0.203: U3.16 14.46,36.22 v14.48,35.18
  Bottom 0.203: v14.48,35.18 12.62,37.04 J1.4
N$58  (via drill 0.33)
  Top 0.203: U3.15 13.97,36.29 | 13.99,36.06 U3.15 | U3.15 13.95,35.61 v13.51,35.18
  Bottom 0.203: J1.3 12.64,40 11.76,39.14 11.76,36.93 v13.51,35.18
N$59  (via drill 0.33)
  Top 0.203: U3.11 11.95,35.6 11.66,35.31 11.66,34.75 11.86,34.54 14.81,34.54 15.88,35.61 15.88,39.32 16.61,40.06 16.61,42.39 v17.07,42.85 | v22.02,47.17 21.36,47.83 19.58,47.83 19.3,48.11 R14.1
  Bottom 0.203: v17.07,42.85 21.39,47.17 v22.02,47.17
N$62
  Top 0.203: D1.C 18.49,49.7 R14.2
PROG  (via drill 0.33)
  Top 0.203: v8.26,42.52 9.03,42.52 U1.5 | v5.64,38.41 R4.1 | U3.10 11.45,35.63 11.02,35.23 10.41,35.23 v10.24,35.41
  Bottom 0.203: v8.26,42.52 4.67,42.52 3.45,41.3 3.45,39.69 R4.1 v5.64,38.41 6.27,37.74 6.27,36.25 7.11,35.41 v10.24,35.41
RESET  (via drill 0.33)
  Top 0.203: 4.8,34.29 4.72,34.37 R6.2 5.59,34.37 v5.64,34.34 | U4.12 14.45,13.99 14.45,14.2 15.32,15.09 15.32,21.13 15.19,21.26 10.24,21.26 10.08,21.11 10.08,20.6 9.78,20.3 v9.75,20.3 | C19.1 v7.44,31.67 7.29,31.52 7.29,24.89 v7.42,24.77
  Bottom 0.203: v9.75,20.3 7.42,22.63 v7.42,24.77 | J2.5 14.91,31.75 13.56,33.1 11.66,33.1 11.3,33.45 6.53,33.45 | 6.53,33.45 v5.64,34.34 | 6.53,33.45 7.44,32.54 v7.44,31.67
RESET-EN
  Top 0.203: JP-L.P$3 2.65,34.37 R6.1
RFN
  Top 0.305: U4.9 12.95,12.74 B1.3
RFP
  Top 0.305: U4.8 12.45,12.74 B1.4
RX0
  Top 0.203: U4.46 9.95,23.05 9.25,23.75 3.27,23.75 JP-L.P$8 2.67,26.42 R15.1
RX1  (via drill 0.33)
  Top 0.203: U4.27 17.58,19.46 18.16,20.04 v18.47,20.04
  Bottom 0.203: v18.47,20.04 18.47,20.14 18.49,20.14 20.34,22 20.34,23.44 20.85,23.95 20.85,25.27 21.16,25.58 21.16,26.85 21.51,27.2 21.51,28.68 21.95,29.11 21.95,30.56 22.33,30.94 22.33,32.33 23.37,33.37 JP-R.P$4
SCK  (via drill 0.33)
  Top 0.203: U4.37 14.45,24.18 13.34,25.3 v13.34,26.9
  Bottom 0.203: JP-L.P$4 2.03,33.37 3.05,32.35 3.05,31.04 4.52,29.57 8.46,29.57 9.07,30.18 9.07,32.11 9.63,32.66 10.87,32.66 11.79,31.75 J2.3 13.59,30.83 13.59,28.73 13.34,28.47 v13.34,26.9
SCL  (via drill 0.33)
  Top 0.203: U4.25 18,18.46 v18.34,18.82 | 23.73,29.39 JP-R.P$6 20.12,29.37 | U5.P$7 18.58,29.37 20.12,29.37 | R22.2 20.12,29.37
  Bottom 0.203: v18.34,18.82 18.34,19.23 18.54,19.43 20.42,19.43 20.78,19.79 20.78,21.13 21.21,21.57 21.21,23.11 21.57,23.47 21.57,24.79 21.92,25.15 21.92,26.49 22.33,26.9 22.33,28.33 23.37,29.37 JP-R.P$6
SDA  (via drill 0.33)
  Top 0.203: U4.26 17.62,18.96 18.09,19.43 18.77,19.43 19.2,19 v19.2,18.82 | JP-R.P$7 24.82,28.44 24.82,30.02 24.51,30.33 22.84,30.33 22.25,30.91 18.52,30.91 18.14,30.54 18.06,30.54 | U5.P$8 18.06,30.24 18.06,30.54 | 18.06,30.54 R23.2
  Bottom 0.203: v19.2,18.82 20.42,18.82 21.18,19.56 21.18,20.95 21.61,21.36 21.61,22.91 21.97,23.27 21.97,24.56 22.3,24.89 22.3,26.3 23.37,27.37 JP-R.P$7
SSN  (via drill 0.33)
  Top 0.203: 14.35,26.82 14.35,26.92 v14.33,26.9 14.33,24.87 14.95,24.24 U4.36
  Bottom 0.203: JP-L.P$7 1.65,27.51 2.46,28.32 8.38,28.32 10.82,25.88 13.26,25.88 14.28,26.9 v14.33,26.9
TX0
  Top 0.203: U4.47 9.45,23.01 9.14,23.32 1.7,23.32 JP-L.P$9 1.47,23.37 0.61,24.23 0.61,28.04 0.99,28.42 3.72,28.42 R8.1 | 9.45,22.66 U4.47 | U4.47
TX1  (via drill 0.33)
  Top 0.203: U4.28 17.52,19.96 18.21,20.65 18.87,20.65 19.3,20.22 v19.3,20.04
  Bottom 0.203: v19.3,20.04 19.28,20.22 20.8,21.74 20.8,23.29 21.21,23.72 21.21,25.04 21.54,25.38 21.54,26.64 21.95,27.05 21.95,28.55 22.35,28.96 22.35,30.35 23.37,31.37 JP-R.P$5
UCAP  (via drill 0.33)
  Top 0.203: 10.87,40.44 10.87,39.01 10.71,38.86 U3.4 9.75,38.86 9.53,38.63 9.53,37.26 v8.74,36.47 | 10.87,40.44 13.23,40.44 13.46,40.66 13.46,41.1 U3.27 13.44,41.12 13.44,41.55 13.66,41.78 15.31,41.78 15.54,42.01 C18.1 15.54,43.2 v15.57,43.23 | 10.92,41.02 10.92,41.08 U3.32 10.95,40.52 10.87,40.44 | D1.A 18.07,48.11 17.73,48.11 v17.37,47.75 17.09,48.03 14.76,48.03 v14.63,47.9 | D2.A 6.18,49.9 v6.17,49.89
  Bottom 0.203: v8.74,36.47 9.61,37.34 J1.2 | v15.57,43.23 16.33,43.23 17.48,44.37 17.48,47.65 v17.37,47.75 | v6.17,49.89 6.96,49.1 13.49,49.1 14.63,47.95 v14.63,47.9
USBD+
  Top 0.203: U3.29 12.42,41.16 12.42,42.38 R10.2
USBD-
  Top 0.203: U3.30 11.95,42.65 R9.2
VBAT  (via drill 0.33)
  Top 0.203: U5.P$3 U5.P$2 15.84,29.32 15.62,29.54 15.62,30.18 18.62,33.17 19.02,33.17 19.23,33.38 v19.23,34.44
  Top 0.305: U1.3 7.28,44.26 7.67,43.87 v9.09,43.87 | v17.32,40.69 18.03,40.69 19.53,42.19 19.53,42.83 Q1.3 | v18.39,36.73 19.15,35.99 19.23,35.92 v19.23,34.44
  Top 0.381: 6.39,45.32 C5.1 v4.64,45.46 4.64,45.43 J4.2 2,43.94 JST.2
  Top 0.406: 6.39,45.32 7.13,45.32 U1.3
  Bottom 0.203: 17.27,40.64 v17.32,40.69
  Bottom 0.305: v9.09,43.87 9.09,43.16 10.26,42.01 16.87,42.01 17.3,41.58 17.3,40.72 v17.32,40.69 17.32,37.8 v18.39,36.73 | v19.23,34.44 19.23,34.77 19.66,35.18 23.56,35.18 JP-R.P$3
VCC  (via drill 0.33)
  Top 0.305: 16.83,17.46 U4.23 16.75,17.46 16.59,17.63 16.59,21.82 16.33,22.07 15.95,22.07 | U4.54 9.09,19.46 | 9.09,19.46 9.25,19.46 9.93,18.78 9.93,18.16 8.73,16.96 U4.59 | 10.97,22.07 15.95,22.07 | U4.44 10.97,22.69 10.97,22.07 | 15.95,22.07 U4.34 15.95,23.35 C11.1 16.64,24.11 16.64,25.35 15.98,26.01 15.98,27.13 15.21,27.89 | 10.97,22.07 9.17,22.07 8.89,21.79 8.89,19.66 9.09,19.46 | U2.5 18.41,35.37 | 10.36,27.89 v10.36,27.86 | 10.36,27.89 15.21,27.89 | U8.P$2 11.22,28.75 10.36,27.89 | 16.59,31.77 15.21,30.4 15.21,27.89 | 16.59,31.77 12.45,31.77 12.33,31.89 U7.P$3 12.25,32.42 R19.1 | R23.1 18.18,31.59 v18.72,32.13 | 16.59,31.77 18.59,33.78 v18.59,33.86 18.54,33.83 18.42,33.95 U2.5 | C2.1 18.42,34.91 U2.5 | R22.1 19.97,30.3 v19.18,30.3
  Bottom 0.305: v10.36,27.86 10.36,29.04 J2.2 | v18.59,33.86 18.59,32.26 v18.72,32.13 18.72,30.76 v19.18,30.3
VCC-AE  (via drill 0.33)
  Top 0.305: U7.P$1 12.83,34.04 14.28,34.04 14.43,33.88 v14.58,33.86 15.33,33.88 C3.1
  Bottom 0.305: v14.58,33.86 14.63,33.83 16.56,35.79 21.97,35.76 22.35,36.14 22.35,37.97 JP-R.P$1
VIN
  Top 0.203: U2.3 16.53,37.99
  Top 0.305: 18.44,37.97 U2.1 18.47,38.53 18.47,39.04 C6.1 | U2.3 16.52,39.36 16.92,39.76 16.95,39.78 18.16,39.78 18.47,39.45 | C6.1 18.49,39.16 18.49,39.41 | 18.49,39.41 18.47,39.45 | 18.47,39.45 18.47,39.88 18.95,40.34 22.4,40.34 23.38,41.31 J3.2 23.38,41.69 24.23,42.55 24.23,45.52 23.44,46.3 20.7,46.3 S1.2 | 18.49,39.41 C6.1
VUSB
  Top 0.203: 14,47.15 USB-JACK.VBUS | 17.25,44.02 Q1.1 | Q1.1 16.91,43.81 16.2,43.1 16.2,41.57 R1.1 | Q1.1 17.5,43.85 D3.A 18.46,46.21 U6.P$4
  Top 0.305: USB-JACK.VBUS 14,46.5 | 14,46.5 13.99,46.51 | U3.31 11.45,41.76 11.25,41.96 10.03,41.96 10.01,41.94 | 14,46.5 14,45.99 14.2,45.8 | 14.2,45.8 14.2,45.27 R20.1 | 14.33,45.1 14.33,45.73 | 14.33,45.73 14.55,45.95 16.8,45.95 D3.A | 14.33,45.73 14.27,45.73 14.2,45.8
  Top 0.381: 13.99,46.51 13.99,47.6 13.69,47.9 11.07,47.9 10.74,47.57 10.74,46.18 10.01,45.44 10.01,41.94 9.68,41.6 7.54,41.6 7.3,41.84 U1.4 7.27,42.12 C4.1 6.3,41.86 6.15,41.71 2.9,41.71 1.65,40.46 JP-L.P$1
  Bottom 0.203: 1.65,39.5 JP-L.P$1

### Text on the board
tPlace: OFF | ON | 3V3 | VUSB | GND | BKPK | VBAT | RST | RX1 | SCK | TX1 | MISO | SCL | MOSI | SDA | SS | AREF | RX0 | A0 | TX0 | A1 | D2 | A2 | D3 | A3 | D4 | A4 | D5 | A5 | D6 | A6 | D7 | A7 | D8
bPlace: pinoccio v1.0 | http://pinocc.io | 2013-08-15 | - | + | switch | 16U2 | 256RFR2
tDocu: Pinoccio(tm) v1.0 | Design by: Eric Jennings for Pinoccio | http://pinocc.io | Licensed under CERN OHL v.1.1